# EAGLE design Chroma-Color (EAGLE 6.5.0)
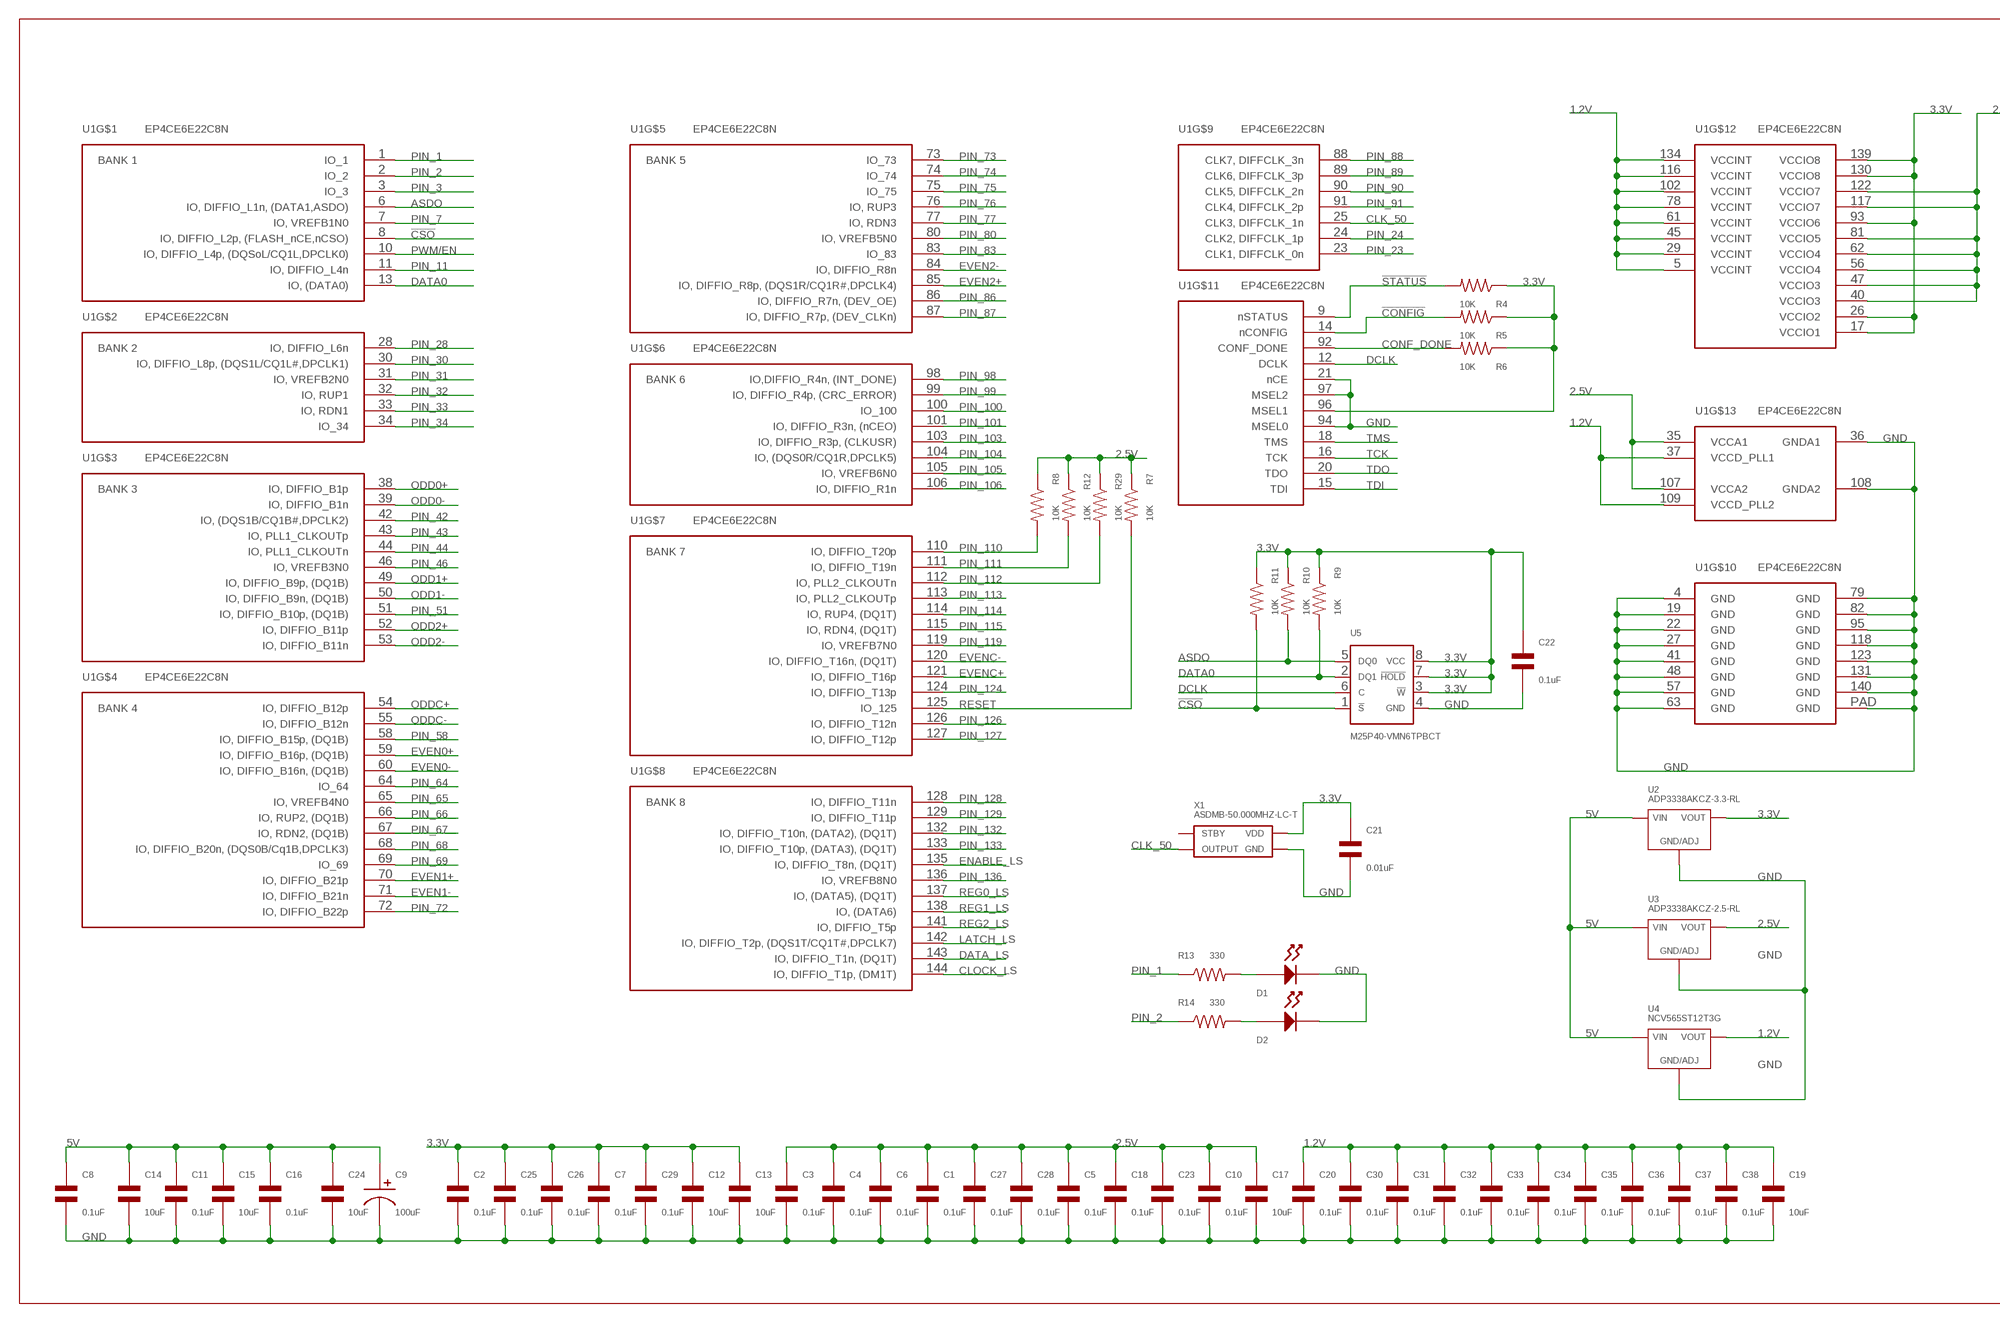
[diagram p0: schematic, sheet 1, part 1 of 2]
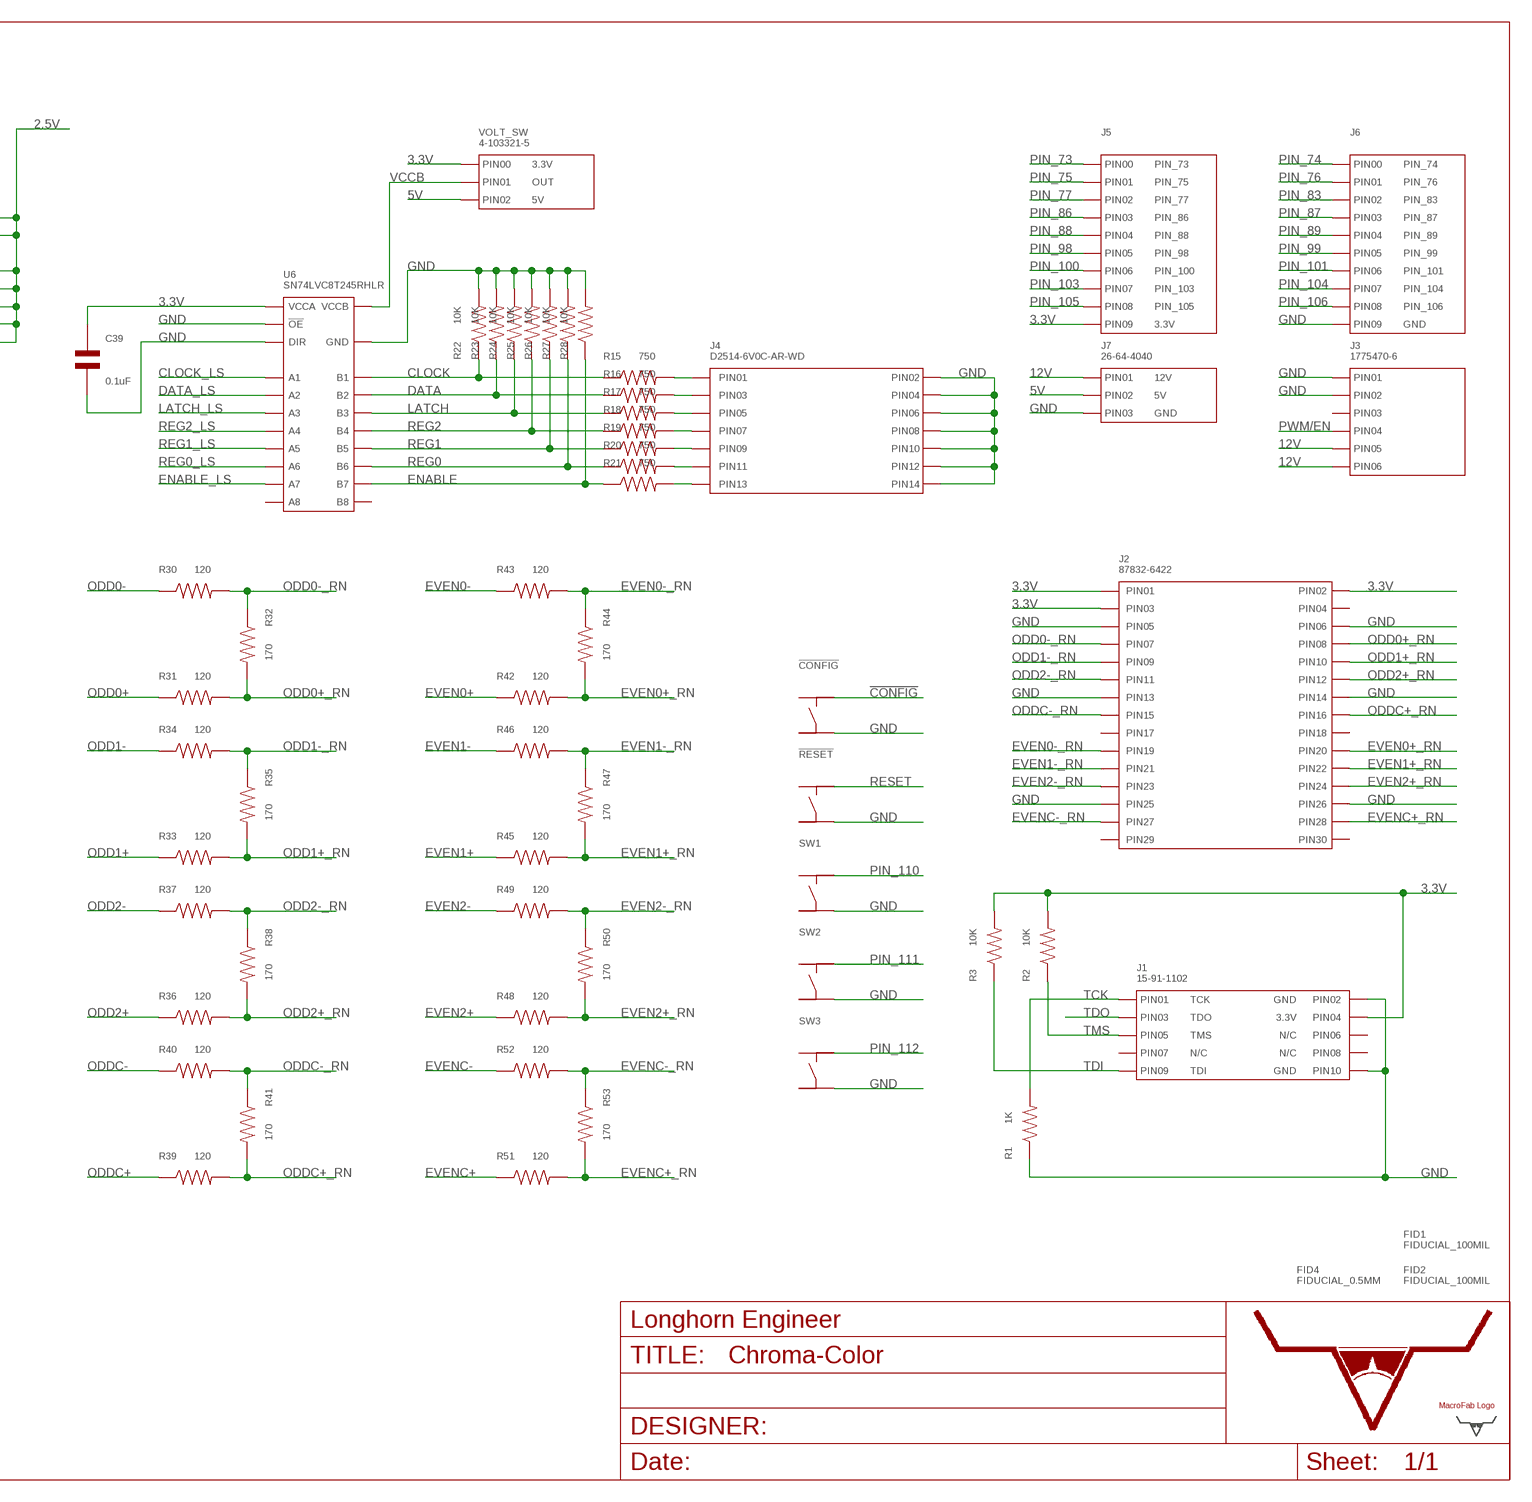
[diagram p1: schematic, sheet 1, part 2 of 2]

## Parts
!CONFIG  TACT_4.2MM  [TACT4.2MM]
!RESET  TACT_4.2MM  [TACT4.2MM]
C1  0.1uF  CAPACITOR_NP_0603  [C0603]
C2  0.1uF  CAPACITOR_NP_0603  [C0603]
C3  0.1uF  CAPACITOR_NP_0603  [C0603]
C4  0.1uF  CAPACITOR_NP_0603  [C0603]
C5  0.1uF  CAPACITOR_NP_0603  [C0603]
C6  0.1uF  CAPACITOR_NP_0603  [C0603]
C7  0.1uF  CAPACITOR_NP_0603  [C0603]
C8  0.1uF  CAPACITOR_NP_0603  [C0603]
C9  100uF  CAPACITOR_P_6.3MM  [CP6.3MM]
C10  0.1uF  CAPACITOR_NP_0603  [C0603]
C11  0.1uF  CAPACITOR_NP_0603  [C0603]
C12  10uF  CAPACITOR_NP_0603  [C0603]
C13  10uF  CAPACITOR_NP_0603  [C0603]
C14  10uF  CAPACITOR_NP_0603  [C0603]
C15  10uF  CAPACITOR_NP_0603  [C0603]
C16  0.1uF  CAPACITOR_NP_0603  [C0603]
C17  10uF  CAPACITOR_NP_0603  [C0603]
C18  0.1uF  CAPACITOR_NP_0603  [C0603]
C19  10uF  CAPACITOR_NP_0603  [C0603]
C20  0.1uF  CAPACITOR_NP_0603  [C0603]
C21  0.01uF  CAPACITOR_NP_0603  [C0603]
C22  0.1uF  CAPACITOR_NP_0603  [C0603]
C23  0.1uF  CAPACITOR_NP_0603  [C0603]
C24  10uF  CAPACITOR_NP_0603  [C0603]
C25  0.1uF  CAPACITOR_NP_0603  [C0603]
C26  0.1uF  CAPACITOR_NP_0603  [C0603]
C27  0.1uF  CAPACITOR_NP_0603  [C0603]
C28  0.1uF  CAPACITOR_NP_0603  [C0603]
C29  0.1uF  CAPACITOR_NP_0603  [C0603]
C30  0.1uF  CAPACITOR_NP_0603  [C0603]
C31  0.1uF  CAPACITOR_NP_0603  [C0603]
C32  0.1uF  CAPACITOR_NP_0603  [C0603]
C33  0.1uF  CAPACITOR_NP_0603  [C0603]
C34  0.1uF  CAPACITOR_NP_0603  [C0603]
C35  0.1uF  CAPACITOR_NP_0603  [C0603]
C36  0.1uF  CAPACITOR_NP_0603  [C0603]
C37  0.1uF  CAPACITOR_NP_0603  [C0603]
C38  0.1uF  CAPACITOR_NP_0603  [C0603]
C39  0.1uF  CAPACITOR_NP_0603  [C0603]
D1  LED_SINGLE_0805  [LED0805]
D2  LED_SINGLE_0805  [LED0805]
FID1  FIDUCIAL_100MIL  [FIDUCIAL_100MIL]
FID2  FIDUCIAL_100MIL  [FIDUCIAL_100MIL]
FID4  FIDUCIAL_0.5MM  [FIDUCIAL_0.5MM]
J1  15-91-1102  CON_02X05_15-91-1102  [15-91-1102]
J2  87832-6422  CON_02X15_87832-6422  [87832-6422]
J3  1775470-6  CON_01X06_1775470-6  [1775470-6]
J4  D2514-6V0C-AR-WD  CON_02X07_D2514-6V0C-AR-WD  [D2514-6V0C-AR-WD]
J5  HEADER_01X10_PTH_2.54MM  [PTH_2.54MM_01X10]
J6  HEADER_01X10_PTH_2.54MM  [PTH_2.54MM_01X10]
J7  26-64-4040  CON_01X03_26-64-4040_(KEYPIN1)  [26-64-4040(KEYPIN1)]
R1  1K  RESISTOR_0603  [R0603]
R2  10K  RESISTOR_0603  [R0603]
R3  10K  RESISTOR_0603  [R0603]
R4  10K  RESISTOR_0603  [R0603]
R5  10K  RESISTOR_0603  [R0603]
R6  10K  RESISTOR_0603  [R0603]
R7  10K  RESISTOR_0603  [R0603]
R8  10K  RESISTOR_0603  [R0603]
R9  10K  RESISTOR_0603  [R0603]
R10  10K  RESISTOR_0603  [R0603]
R11  10K  RESISTOR_0603  [R0603]
R12  10K  RESISTOR_0603  [R0603]
R13  330  RESISTOR_0603  [R0603]
R14  330  RESISTOR_0603  [R0603]
R15  750  RESISTOR_0603  [R0603]
R16  750  RESISTOR_0603  [R0603]
R17  750  RESISTOR_0603  [R0603]
R18  750  RESISTOR_0603  [R0603]
R19  750  RESISTOR_0603  [R0603]
R20  750  RESISTOR_0603  [R0603]
R21  750  RESISTOR_0603  [R0603]
R22  10K  RESISTOR_0603  [R0603]
R23  10K  RESISTOR_0603  [R0603]
R24  10K  RESISTOR_0603  [R0603]
R25  10K  RESISTOR_0603  [R0603]
R26  10K  RESISTOR_0603  [R0603]
R27  10K  RESISTOR_0603  [R0603]
R28  10K  RESISTOR_0603  [R0603]
R29  10K  RESISTOR_0603  [R0603]
R30  120  RESISTOR_0402  [R0402]
R31  120  RESISTOR_0402  [R0402]
R32  170  RESISTOR_0402  [R0402]
R33  120  RESISTOR_0402  [R0402]
R34  120  RESISTOR_0402  [R0402]
R35  170  RESISTOR_0402  [R0402]
R36  120  RESISTOR_0402  [R0402]
R37  120  RESISTOR_0402  [R0402]
R38  170  RESISTOR_0402  [R0402]
R39  120  RESISTOR_0402  [R0402]
R40  120  RESISTOR_0402  [R0402]
R41  170  RESISTOR_0402  [R0402]
R42  120  RESISTOR_0402  [R0402]
R43  120  RESISTOR_0402  [R0402]
R44  170  RESISTOR_0402  [R0402]
R45  120  RESISTOR_0402  [R0402]
R46  120  RESISTOR_0402  [R0402]
R47  170  RESISTOR_0402  [R0402]
R48  120  RESISTOR_0402  [R0402]
R49  120  RESISTOR_0402  [R0402]
R50  170  RESISTOR_0402  [R0402]
R51  120  RESISTOR_0402  [R0402]
R52  120  RESISTOR_0402  [R0402]
R53  170  RESISTOR_0402  [R0402]
SW1  TACT_4.2MM  [TACT4.2MM]
SW2  TACT_4.2MM  [TACT4.2MM]
SW3  TACT_4.2MM  [TACT4.2MM]
U1  EP4CE6E22C8N  [EQFP-144]
U2  ADP3338AKCZ-3.3-RL  LINEAR_VOTLAGE_REGULATORS_ADP3338  [ADP3338_SOT-223-3]
U3  ADP3338AKCZ-2.5-RL  LINEAR_VOTLAGE_REGULATORS_ADP3338  [ADP3338_SOT-223-3]
U4  NCV565ST12T3G  LINEAR_VOTLAGE_REGULATORS_NCV565ST12T3G  [NCV565_SOT-223-3]
U5  M25P40-VMN6TPBCT  [M25P40_SOIC-8]
U6  SN74LVC8T245RHLR  SN74LVC8T245_RHL  [SN74LVC8T245_VQFN-24]
U$1  LHE_FRAME  [LHE_FRAME]
U$2  MF_LOGOLOGO_MEDIUM  [MF_LOGO_MEDIUM]
U$3  LHE_LOGOLHE_LOGO  [LHE_LOGO]
VOLT_SW  4-103321-5  HEADER_01X03_PTH_2.54MM  [PTH_2.54MM_01X03]
X1  ASDMB-50.000MHZ-LC-T  ASDMB  [ASDMB]

## Nets
1.2V: C19.P$1 C20.P$1 C30.P$1 C31.P$1 C32.P$1 C33.P$1 C34.P$1 C35.P$1 C36.P$1 C37.P$1 C38.P$1 U1.5 U1.29 U1.37 U1.45 U1.61 U1.78 U1.102 U1.109 U1.116 U1.134 U4.2(OUT) U4.PAD(OUT)
2.5V: C1.P$1 C3.P$1 C4.P$1 C5.P$1 C6.P$1 C10.P$1 C17.P$1 C18.P$1 C23.P$1 C27.P$1 C28.P$1 R7.P$1 R8.P$1 R12.P$1 R29.P$1 U1.35 U1.40 U1.47 U1.56 U1.62 U1.81 U1.107 U1.117 U1.122 U3.2(OUT) U3.PAD(OUT)
3.3V: C2.P$1 C7.P$1 C12.P$1 C13.P$1 C21.P$1 C22.P$1 C25.P$1 C26.P$1 C29.P$1 C39.P$1 J1.4(PIN4) J2.P$1(PIN0) J2.P$2(PIN1) J2.P$3(PIN2) J5.P$10(PIN9) R2.P$2 R3.P$2 R4.P$1 R5.P$1 R6.P$1 R9.P$1 R10.P$1 R11.P$1 U1.17 U1.26 U1.93 U1.96 U1.130 U1.139 U2.2(OUT) U2.PAD(OUT) U5.3(!W) U5.7(!HOLD) U5.8(VCC) U6.1(VCCA) VOLT_SW.P$1(PIN0) X1.P$4(VDD)
5V: C8.P$1 C9.P$1 C11.P$1 C14.P$1 C15.P$1 C16.P$1 C24.P$1 J7.3(PIN2) U2.3(IN) U3.3(IN) U4.3(IN) VOLT_SW.P$3(PIN2)
12V: J3.P$5 J3.P$6 J7.2(PIN1)
!CONFIG: !CONFIG.P$2 R5.P$2 U1.14
!CSO: R11.P$2 U1.8 U5.1(!S)
!STATUS: R4.P$2 U1.9
ASDO: R10.P$2 U1.6 U5.5(DQ0)
CLK_50: U1.25 X1.P$3(OUTPUT)
CLOCK: R15.P$1 R22.P$1 U6.21(B1)
CLOCK_LS: U1.144 U6.3(A1)
CONF_DONE: R6.P$2 U1.92
DATA: R16.P$1 R23.P$1 U6.20(B2)
DATA0: R9.P$2 U1.13 U5.2(DQ1)
DATA_LS: U1.143 U6.4(A2)
DCLK: U1.12 U5.6(C)
ENABLE: R21.P$1 R28.P$1 U6.15(B7)
ENABLE_LS: U1.135 U6.9(A7)
EVEN0+: R42.P$1 U1.59
EVEN0+_RN: J2.P$20(PIN19) R42.P$2 R44.P$2
EVEN0-: R43.P$1 U1.60
EVEN0-_RN: J2.P$19(PIN18) R43.P$2 R44.P$1
EVEN1+: R45.P$1 U1.70
EVEN1+_RN: J2.P$22(PIN21) R45.P$2 R47.P$2
EVEN1-: R46.P$1 U1.71
EVEN1-_RN: J2.P$21(PIN20) R46.P$2 R47.P$1
EVEN2+: R48.P$1 U1.85
EVEN2+_RN: J2.P$24(PIN23) R48.P$2 R50.P$2
EVEN2-: R49.P$1 U1.84
EVEN2-_RN: J2.P$23(PIN22) R49.P$2 R50.P$1
EVENC+: R51.P$1 U1.121
EVENC+_RN: J2.P$28(PIN27) R51.P$2 R53.P$2
EVENC-: R52.P$1 U1.120
EVENC-_RN: J2.P$27(PIN26) R52.P$2 R53.P$1
GND: !CONFIG.P$4 !RESET.P$4 C1.P$2 C2.P$2 C3.P$2 C4.P$2 C5.P$2 C6.P$2 C7.P$2 C8.P$2 C9.P$2 C10.P$2 C11.P$2 C12.P$2 C13.P$2 C14.P$2 C15.P$2 C16.P$2 C17.P$2 C18.P$2 C19.P$2 C20.P$2 C21.P$2 C22.P$2 C23.P$2 C24.P$2 C25.P$2 C26.P$2 C27.P$2 C28.P$2 C29.P$2 C30.P$2 C31.P$2 C32.P$2 C33.P$2 C34.P$2 C35.P$2 C36.P$2 C37.P$2 C38.P$2 C39.P$2 D1.CATHODE D2.CATHODE J1.2(PIN2) J1.10(PIN10) J2.P$5(PIN4) J2.P$6(PIN5) J2.P$13(PIN12) J2.P$14(PIN13) J2.P$25(PIN24) J2.P$26(PIN25) J3.P$1 J3.P$2 J4.2(PIN2) J4.4(PIN4) J4.6(PIN6) J4.8(PIN8) J4.10(PIN10) J4.12(PIN12) J4.14(PIN14) J6.P$10(PIN9) J7.4(PIN3) R1.P$1 R22.P$2 R23.P$2 R24.P$2 R25.P$2 R26.P$2 R27.P$2 R28.P$2 SW1.P$4 SW2.P$4 SW3.P$4 U1.4 U1.19 U1.21 U1.22 U1.27 U1.36 U1.41 U1.48 U1.57 U1.63 U1.79 U1.82 U1.94 U1.95 U1.97 U1.108 U1.118 U1.123 U1.131 U1.140 U1.PAD U2.1(GND) U3.1(GND) U4.1(GND) U5.4(GND) U6.2(DIR) U6.11(GND) U6.12(GND) U6.13(GND) U6.22(!OE) X1.P$2(GND)
LATCH: R17.P$1 R24.P$1 U6.19(B3)
LATCH_LS: U1.142 U6.5(A3)
N$1: D1.ANODE R13.P$2
N$2: D2.ANODE R14.P$2
N$3: J4.1(PIN1) R15.P$2
N$4: J4.3(PIN3) R16.P$2
N$5: J4.5(PIN5) R17.P$2
N$6: J4.7(PIN7) R18.P$2
N$7: J4.9(PIN9) R19.P$2
N$8: J4.11(PIN11) R20.P$2
N$9: J4.13(PIN13) R21.P$2
ODD0+: R31.P$1 U1.38
ODD0+_RN: J2.P$8(PIN7) R31.P$2 R32.P$2
ODD0-: R30.P$1 U1.39
ODD0-_RN: J2.P$7(PIN6) R30.P$2 R32.P$1
ODD1+: R33.P$1 U1.49
ODD1+_RN: J2.P$10(PIN9) R33.P$2 R35.P$2
ODD1-: R34.P$1 U1.50
ODD1-_RN: J2.P$9(PIN8) R34.P$2 R35.P$1
ODD2+: R36.P$1 U1.52
ODD2+_RN: J2.P$12(PIN11) R36.P$2 R38.P$2
ODD2-: R37.P$1 U1.53
ODD2-_RN: J2.P$11(PIN10) R37.P$2 R38.P$1
ODDC+: R39.P$1 U1.54
ODDC+_RN: J2.P$16(PIN15) R39.P$2 R41.P$2
ODDC-: R40.P$1 U1.55
ODDC-_RN: J2.P$15(PIN14) R40.P$2 R41.P$1
PIN_1: R13.P$1 U1.1
PIN_2: R14.P$1 U1.2
PIN_3: U1.3
PIN_7: U1.7
PIN_11: U1.11
PIN_23: U1.23
PIN_24: U1.24
PIN_28: U1.28
PIN_30: U1.30
PIN_31: U1.31
PIN_32: U1.32
PIN_33: U1.33
PIN_34: U1.34
PIN_42: U1.42
PIN_43: U1.43
PIN_44: U1.44
PIN_46: U1.46
PIN_51: U1.51
PIN_58: U1.58
PIN_64: U1.64
PIN_65: U1.65
PIN_66: U1.66
PIN_67: U1.67
PIN_68: U1.68
PIN_69: U1.69
PIN_72: U1.72
PIN_73: J5.P$1(PIN0) U1.73
PIN_74: J6.P$1(PIN0) U1.74
PIN_75: J5.P$2(PIN1) U1.75
PIN_76: J6.P$2(PIN1) U1.76
PIN_77: J5.P$3(PIN2) U1.77
PIN_80: U1.80
PIN_83: J6.P$3(PIN2) U1.83
PIN_86: J5.P$4(PIN3) U1.86
PIN_87: J6.P$4(PIN3) U1.87
PIN_88: J5.P$5(PIN4) U1.88
PIN_89: J6.P$5(PIN4) U1.89
PIN_90: U1.90
PIN_91: U1.91
PIN_98: J5.P$6(PIN5) U1.98
PIN_99: J6.P$6(PIN5) U1.99
PIN_100: J5.P$7(PIN6) U1.100
PIN_101: J6.P$7(PIN6) U1.101
PIN_103: J5.P$8(PIN7) U1.103
PIN_104: J6.P$8(PIN7) U1.104
PIN_105: J5.P$9(PIN8) U1.105
PIN_106: J6.P$9(PIN8) U1.106
PIN_110: R8.P$2 SW1.P$2 U1.110
PIN_111: R12.P$2 SW2.P$2 U1.111
PIN_112: R29.P$2 SW3.P$2 U1.112
PIN_113: U1.113
PIN_114: U1.114
PIN_115: U1.115
PIN_119: U1.119
PIN_124: U1.124
PIN_126: U1.126
PIN_127: U1.127
PIN_128: U1.128
PIN_129: U1.129
PIN_132: U1.132
PIN_133: U1.133
PIN_136: U1.136
PWM/EN: J3.P$4 U1.10
REG0: R20.P$1 R27.P$1 U6.16(B6)
REG0_LS: U1.137 U6.8(A6)
REG1: R19.P$1 R26.P$1 U6.17(B5)
REG1_LS: U1.138 U6.7(A5)
REG2: R18.P$1 R25.P$1 U6.18(B4)
REG2_LS: U1.141 U6.6(A4)
RESET: !RESET.P$2 R7.P$2 U1.125
TCK: J1.1(PIN1) R1.P$2 U1.16
TDI: J1.9(PIN9) R3.P$1 U1.15
TDO: J1.3(PIN3) U1.20
TMS: J1.5(PIN5) R2.P$1 U1.18
VCCB: U6.23(VCCB) U6.24(VCCB) VOLT_SW.P$2(PIN1)
Unconnected: !CONFIG.P$1 !CONFIG.P$3 !RESET.P$1 !RESET.P$3 J1.6(PIN6) J1.7(PIN7) J1.8(PIN8) J2.P$4(PIN3) J2.P$17(PIN16) J2.P$18(PIN17) J2.P$29(PIN28) J2.P$30(PIN29) J3.P$3 SW1.P$1 SW1.P$3 SW2.P$1 SW2.P$3 SW3.P$1 SW3.P$3 U6.10(A8) U6.14(B8) X1.P$1(STBY)

## Library data of the parts
!CONFIG !RESET SW1-SW3 = MF_Switches:TACT: Library: MF_Switches Description: Device for Tact Switches. Manufacture part number (MFG#) can be added via Attributes.
C1-C8 C10-C39 = MF_Passives:CAPACITOR_NP: Library: MF_Passives Description: Device for Non-Polarized Capacitors. Manufacture part number (MFG#), Voltage, Temperature Coefficient, and Tolerance can be added via Attributes.; MFG#: N/A; TEMP_COF: N/A; TOLERANCE: N/A; VOLTAGE: N/A
C9 = MF_Passives:CAPACITOR_P: Library: MF_Passives Description: Device for Polarized Capacitors. Manufacture part number (MFG#), Voltage Rating, and Tolerance can be added via Attributes.; MFG#: N/A; TOLERANCE: N/A; VOTLAGE: N/A
D1 D2 = MF_LEDs:LED_SINGLE: Library: MF_LEDs Description: Device for Single LED Packages. Manufacture part number (MFG#) can be added via Attributes.
FID1 FID2 FID4 = MF_Aesthetics:FIDUCIAL: Library: MF_Aesthetics Description: Fiducial marking for PCB alignment inside PNP and other machines.
J1 = PP_Connectors:CON_02X05; LABEL01: TCK; LABEL02: GND; LABEL03: TDO; LABEL04: 3.3V; LABEL05: TMS; LABEL06: N/C; LABEL07: N/C; LABEL08: N/C; LABEL09: TDI; LABEL10: GND
J2 = PP_Connectors:CON_02X15
J3 = PP_Connectors:CON_01X06: 6 pin connectors
J4 = PP_Connectors:CON_02X07
J5 = MF_Connectors:HEADER_01X10: Library: MF_Connectors Description: Header Connector with 10 Positions and 01 Rows. Use the LABEL Attribute to label the pin on the schematic and PCB. You can remove the attributes on the PCB by using the SMASH function on the part and then deleting the text.; LABEL00: PIN_73; LABEL01: PIN_75; LABEL02: PIN_77; LABEL03: PIN_86; LABEL04: PIN_88; LABEL05: PIN_98; LABEL06: PIN_100; LABEL07: PIN_103; LABEL08: PIN_105; LABEL09: 3.3V
J6 = MF_Connectors:HEADER_01X10: Library: MF_Connectors Description: Header Connector with 10 Positions and 01 Rows. Use the LABEL Attribute to label the pin on the schematic and PCB. You can remove the attributes on the PCB by using the SMASH function on the part and then deleting the text.; LABEL00: PIN_74; LABEL01: PIN_76; LABEL02: PIN_83; LABEL03: PIN_87; LABEL04: PIN_89; LABEL05: PIN_99; LABEL06: PIN_101; LABEL07: PIN_104; LABEL08: PIN_106; LABEL09: GND
J7 = PP_Connectors:CON_01X03: 3 pin connectors; LABEL01: 12V; LABEL02: 5V; LABEL03: GND
R1-R53 = MF_Passives:RESISTOR: Library: MF_Passives Description: Device for Resistors. Manufacture part number (MFG#), Voltage, Tolerance, and Wattage Rating can be added via Attributes.; MFG#: N/A; TOLERANCE: N/A; VOLTAGE: N/A; WATTAGE: N/A
U1 = PP_DigitalIC:EP4CE6E22C8N: Manufacturer Part #: EP4CE6E22C8N Manufacturer: Altera Description: FPGA - Field Programmable Gate Array FPGA - Cyclone IV E 392 LABs 91 IOs URL: http://www.mouser.com/ds/2/591/cyiv-51001-472857.pdf
U2-U4 = PP_PowerIC:LINEAR_VOTLAGE_REGULATORS
U5 = PP_DigitalIC:M25P40: Manufacturer Part #: M25P40 Manufacturer: Micron Technology Inc. Description: IC FLASH 4MBIT 75MHZ
U6 = PP_DigitalIC:SN74LVC8T245: Manufacturer Part #: SN74LVC8T245 Manufacturer: Texas Instruments Description: Translation - Voltage Levels 8-Bit Dual-Supply Bus Xcvr
U$1 = PP_Aesthetics:LHE_FRAME; DNAME: Parker Dillmann; REVNUM: REV: 2
U$2 = PP_Aesthetics:MF_LOGO
U$3 = PP_Aesthetics:LHE_LOGO
VOLT_SW = MF_Connectors:HEADER_01X03: Library: MF_Connectors Description: Header Connector with 03 Positions and 01 Rows. Use the LABEL Attribute to label the pin on the schematic and PCB. You can remove the attributes on the PCB by using the SMASH function on the part and then deleting the text.; LABEL00: 3.3V; LABEL01: OUT; LABEL02: 5V
X1 = PP_FreqCtrl:ASDMB: Manufacturer Part #: ASDMB series clock oscillator Manufacturer: ABRACON Description: Standard Clock Oscillators

## Board
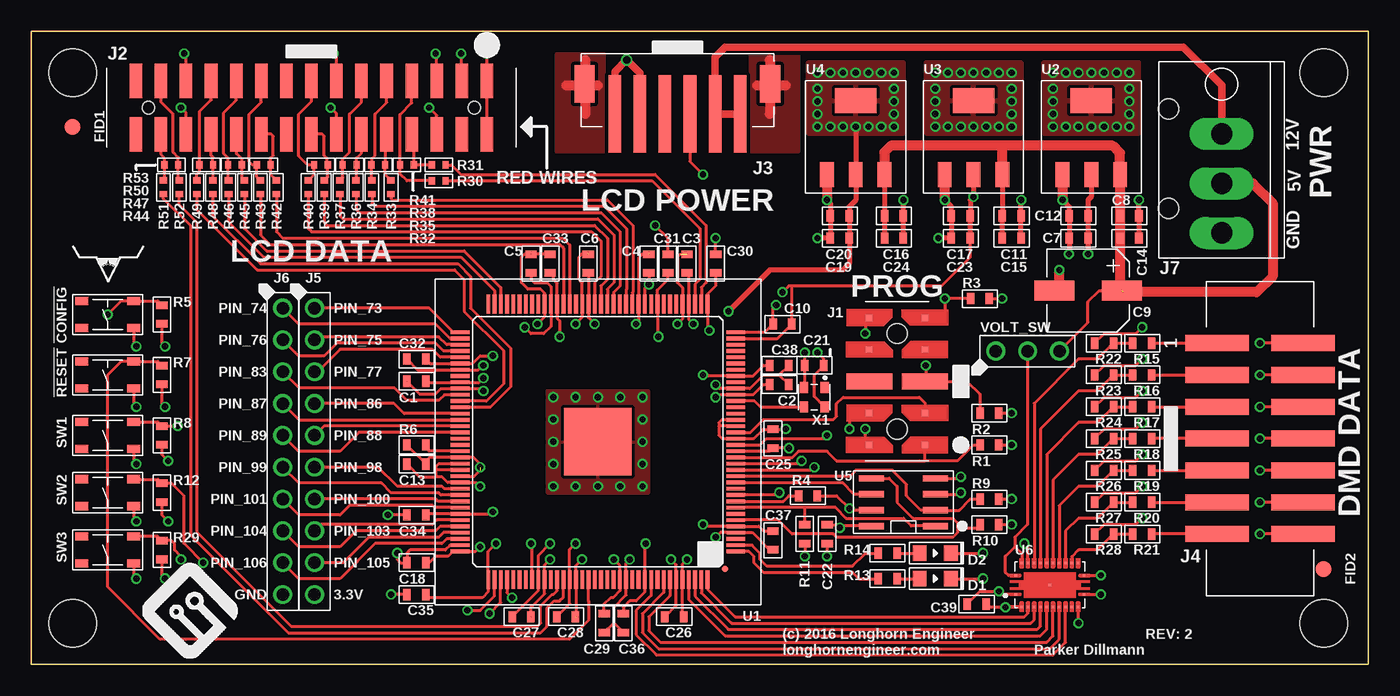
[diagram p2: board, top side]
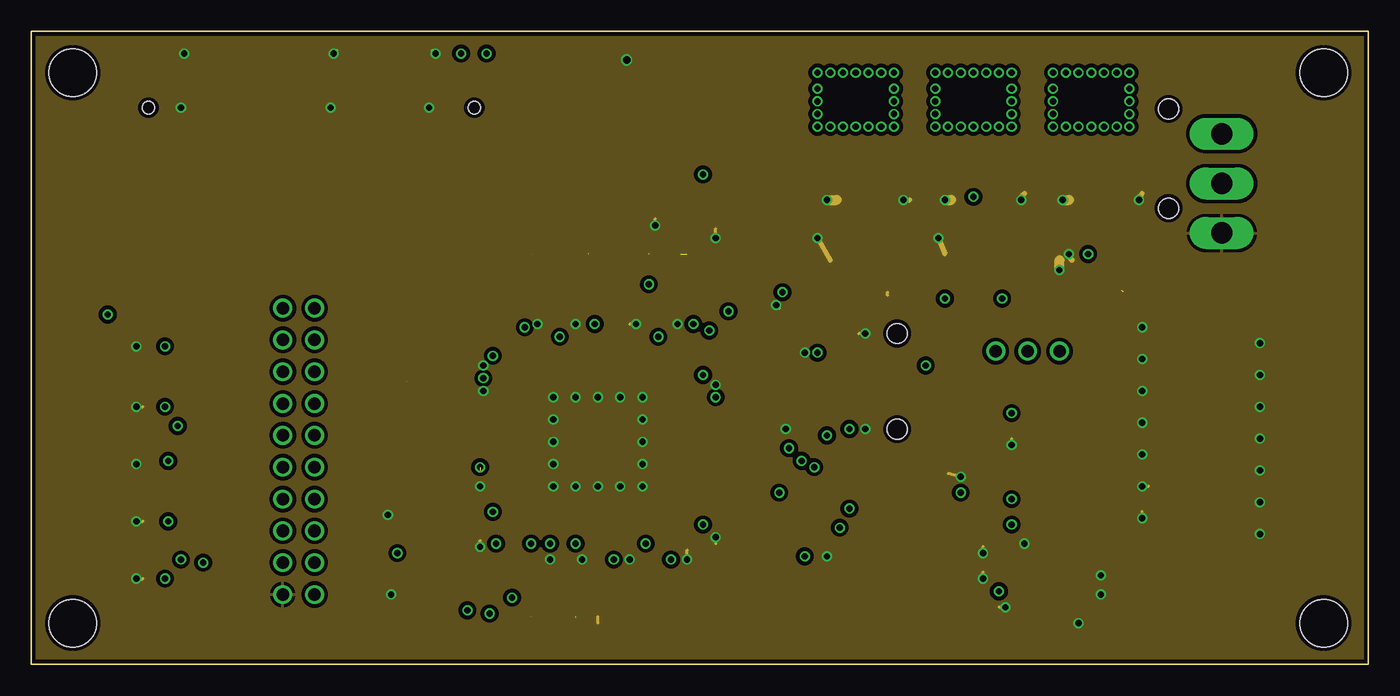
[diagram p3: board, inner layer Route2]
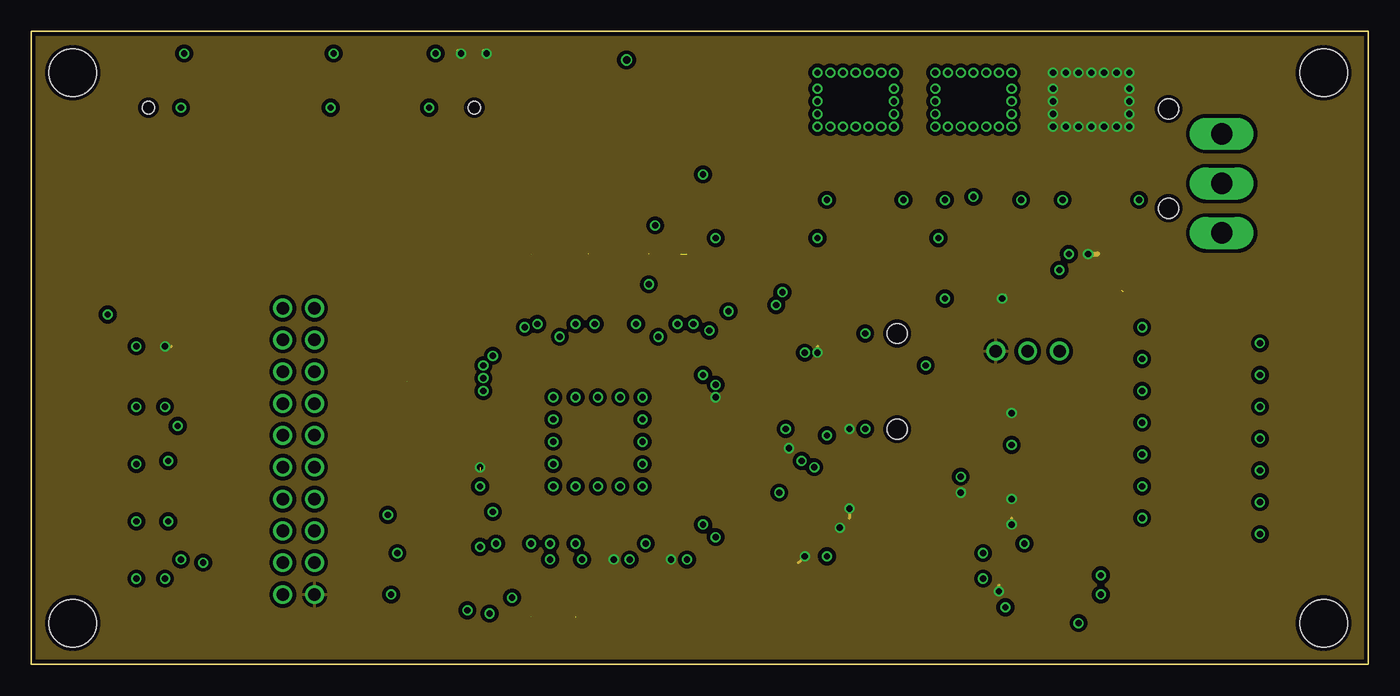
[diagram p4: board, inner layer Route15]
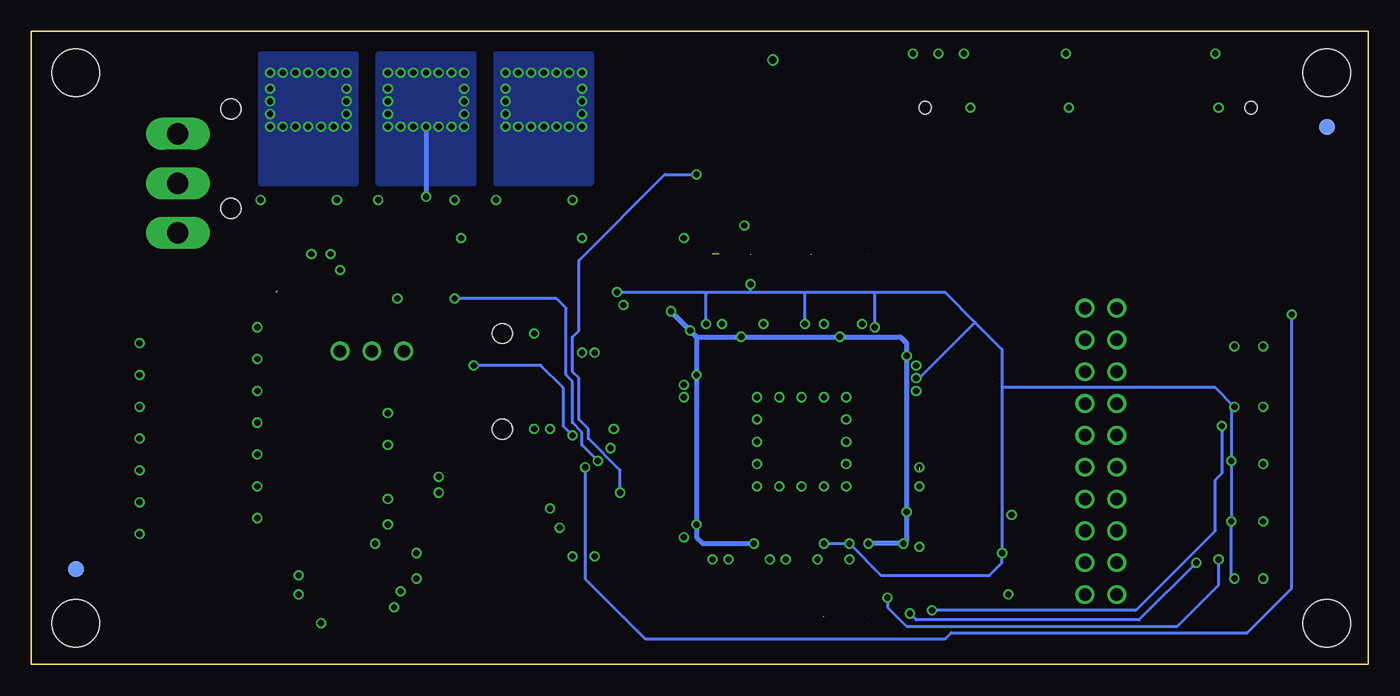
[diagram p5: board, bottom side, seen from below]

Size 106.68 x 50.55 mm. Coordinates in mm from the lower left corner, seen from the top.
Outline: 0,0 0,50.55 106.68,50.55 106.68,0 0,0
Copper layers (1*2*15*16): Top 0.035mm / dielectric 0.23mm / Route2 0.035mm / dielectric 0.93mm / Route15 0.035mm / dielectric 0.23mm / Bottom 0.035mm
Design rules "MF_Standard_4_Layer": minimum track width 6mil, minimum drill 12mil, track to track 6mil, track to pad 6mil, pad to pad 6mil, via to via 6mil, smd to smd 0mil, copper to edge 10mil, drill to drill 10mil, minimum pad ring 6mil, minimum via ring 6mil, stop-mask expansion 2mil, vias tented up to drill 25mil, thermal gap 10mil
Holes 3.8 mm at 3.3,3.3 103.12,3.3 103.12,47.24 3.3,47.24

### Footprints (pad centres in the part's own frame; a part is rotated, then mirrored left to right if it is on the bottom)
TACT4.2MM = smd 1.05 x 0.65: P$1 -2.075,1.075; P$2 2.075,1.075; P$3 -2.075,-1.075; P$4 2.075,-1.075
C0603 = smd 0.6 x 0.9: P$1 -0.75,0; P$2 0.75,0
CP6.3MM = smd 1.6 x 3.2: P$1 0,-2.7; P$2 0,2.7
LED0805 = smd 1.1 x 1.25: ANODE 1.25,0; CATHODE -1.25,0
FIDUCIAL_100MIL = smd 1.27 x 1.27: P$1 0,0 | smd 1.27 x 1.27 bottom: P$2 0,0
FIDUCIAL_0.5MM = smd 0.5 x 0.5: FID 0,0
15-91-1102 = smd 0.5 x 0.5: 1 -5.08,-2.22; 2 -5.08,2.22; 3 -2.54,-2.22; 4 -2.54,2.22; 7 2.54,-2.22; 8 2.54,2.22; 9 5.08,-2.22; 10 5.08,2.22 | smd 1.27 x 3.68: 5 0,-2.22; 6 0,2.22 | hole 1.6: -3.81,0; 3.81,0
87832-6422 = smd 1 x 2.75: P$1 -14,-2.125; P$2 -14,2.125; P$3 -12,-2.125; P$4 -12,2.125; P$5 -10,-2.125; P$6 -10,2.125; P$7 -8,-2.125; P$8 -8,2.125; P$9 -6,-2.125; P$10 -6,2.125; P$11 -4,-2.125; P$12 -4,2.125; P$13 -2,-2.125; P$14 -2,2.125; P$15 0,-2.125; P$16 0,2.125; P$17 2,-2.125; P$18 2,2.125; P$19 4,-2.125; P$20 4,2.125; P$21 6,-2.125; P$22 6,2.125; P$23 8,-2.125; P$24 8,2.125; P$25 10,-2.125; P$26 10,2.125; P$27 12,-2.125; P$28 12,2.125; P$29 14,-2.125; P$30 14,2.125 | hole 1: -13,0; 13,0
1775470-6 = smd 1 x 6.2: P$1 5,0; P$2 3,0; P$3 1,0; P$4 -1,0; P$5 -3,0; P$6 -5,0 | smd 1.6 x 3: S0 -7.4,-2.4; S1 7.4,-2.4
D2514-6V0C-AR-WD = smd 1.27 x 5.08: 1 -7.62,-3.429; 2 -7.62,3.429; 3 -5.08,-3.429; 4 -5.08,3.429; 5 -2.54,-3.429; 6 -2.54,3.429; 7 0,-3.429; 8 0,3.429; 9 2.54,-3.429; 10 2.54,3.429; 11 5.08,-3.429; 12 5.08,3.429; 13 7.62,-3.429; 14 7.62,3.429
PTH_2.54MM_01X10 = drill 1: P$1 -11.43,0; P$2 -8.89,0; P$3 -6.35,0; P$4 -3.81,0; P$5 -1.27,0; P$6 1.27,0; P$7 3.81,0; P$8 6.35,0; P$9 8.89,0; P$10 11.43,0
26-64-4040(KEYPIN1) = drill 1.702 long: 2 -1.98,0; 3 1.98,0; 4 5.94,0 | hole 1.6: 3.96,-4.24; -3.96,-4.24
R0603 = smd 0.6 x 0.9: P$1 -0.75,0; P$2 0.75,0
R0402 = smd 0.5 x 0.6: P$1 -0.55,0; P$2 0.55,0
EQFP-144 = smd 1.5 x 0.3: 1 -11,8.75; 2 -11,8.25; 3 -11,7.75; 4 -11,7.25; 5 -11,6.75; 6 -11,6.25; 7 -11,5.75; 8 -11,5.25; 9 -11,4.75; 10 -11,4.25; 11 -11,3.75; 12 -11,3.25; 13 -11,2.75; 14 -11,2.25; 15 -11,1.75; 16 -11,1.25; 17 -11,0.75; 18 -11,0.25; 19 -11,-0.25; 20 -11,-0.75; 21 -11,-1.25; 22 -11,-1.75; 23 -11,-2.25; 24 -11,-2.75; 25 -11,-3.25; 26 -11,-3.75; 27 -11,-4.25; 28 -11,-4.75; 29 -11,-5.25; 30 -11,-5.75; 31 -11,-6.25; 32 -11,-6.75; 33 -11,-7.25; 34 -11,-7.75; 35 -11,-8.25; 36 -11,-8.75; 73 11,-8.75; 74 11,-8.25; 75 11,-7.75; 76 11,-7.25; 77 11,-6.75; 78 11,-6.25; 79 11,-5.75; 80 11,-5.25; 81 11,-4.75; 82 11,-4.25; 83 11,-3.75; 84 11,-3.25; 85 11,-2.75; 86 11,-2.25; 87 11,-1.75; 88 11,-1.25; 89 11,-0.75; 90 11,-0.25; 91 11,0.25; 92 11,0.75; 93 11,1.25; 94 11,1.75; 95 11,2.25; 96 11,2.75; 97 11,3.25; 98 11,3.75; 99 11,4.25; 100 11,4.75; 101 11,5.25; 102 11,5.75; 103 11,6.25; 104 11,6.75; 105 11,7.25; 106 11,7.75; 107 11,8.25; 108 11,8.75 | smd 0.3 x 1.5: 37 -8.75,-11; 38 -8.25,-11; 39 -7.75,-11; 40 -7.25,-11; 41 -6.75,-11; 42 -6.25,-11; 43 -5.75,-11; 44 -5.25,-11; 45 -4.75,-11; 46 -4.25,-11; 47 -3.75,-11; 48 -3.25,-11; 49 -2.75,-11; 50 -2.25,-11; 51 -1.75,-11; 52 -1.25,-11; 53 -0.75,-11; 54 -0.25,-11; 55 0.25,-11; 56 0.75,-11; 57 1.25,-11; 58 1.75,-11; 59 2.25,-11; 60 2.75,-11; 61 3.25,-11; 62 3.75,-11; 63 4.25,-11; 64 4.75,-11; 65 5.25,-11; 66 5.75,-11; 67 6.25,-11; 68 6.75,-11; 69 7.25,-11; 70 7.75,-11; 71 8.25,-11; 72 8.75,-11; 109 8.75,11; 110 8.25,11; 111 7.75,11; 112 7.25,11; 113 6.75,11; 114 6.25,11; 115 5.75,11; 116 5.25,11; 117 4.75,11; 118 4.25,11; 119 3.75,11; 120 3.25,11; 121 2.75,11; 122 2.25,11; 123 1.75,11; 124 1.25,11; 125 0.75,11; 126 0.25,11; 127 -0.25,11; 128 -0.75,11; 129 -1.25,11; 130 -1.75,11; 131 -2.25,11; 132 -2.75,11; 133 -3.25,11; 134 -3.75,11; 135 -4.25,11; 136 -4.75,11; 137 -5.25,11; 138 -5.75,11; 139 -6.25,11; 140 -6.75,11; 141 -7.25,11; 142 -7.75,11; 143 -8.25,11; 144 -8.75,11 | smd 5.4 x 5.4: PAD 0,0
ADP3338_SOT-223-3 = smd 1.1 x 2: 1 -2.3,-2.54; 2 0,-2.54; 3 2.3,-2.54 | smd 3.3 x 2: PAD 0,3.36
NCV565_SOT-223-3 = smd 1.1 x 2: 1 -2.3,-2.54; 2 0,-2.54; 3 2.3,-2.54 | smd 3.3 x 2: PAD 0,3.36
M25P40_SOIC-8 = smd 2 x 0.5: 1 -2.55,1.905; 2 -2.55,0.635; 3 -2.55,-0.635; 4 -2.55,-1.905; 5 2.55,-1.905; 6 2.55,-0.635; 7 2.55,0.635; 8 2.55,1.905
SN74LVC8T245_VQFN-24 = smd 0.2 x 0.2: 1 -2.75,-0.75; 2 -2.25,-1.75; 3 -1.75,-1.75; 4 -1.25,-1.75; 5 -0.75,-1.75; 6 -0.25,-1.75; 7 0.25,-1.75; 8 0.75,-1.75; 9 1.25,-1.75; 10 1.75,-1.75; 11 2.25,-1.75; 12 2.75,-0.75; 13 2.75,0.75; 14 2.25,1.75; 15 1.75,1.75; 16 1.25,1.75; 17 0.75,1.75; 18 0.25,1.75; 19 -0.25,1.75; 20 -0.75,1.75; 21 -1.25,1.75; 22 -1.75,1.75; 23 -2.25,1.75; 24 -2.75,0.75; TP 0,0
PTH_2.54MM_01X03 = drill 1: P$1 -2.54,0; P$2 0,0; P$3 2.54,0
ASDMB = smd 0.65 x 0.85: P$1 -0.825,-0.775; P$2 0.825,-0.775; P$3 0.825,0.775; P$4 -0.825,0.775

### Placement (x,y rotation side)
!CONFIG  6.1,27.94 0 top
!RESET  6.1,23.11 0 top
C1  30.73,22.61 180 top
C2  59.69,22.35 0 top
C3  52.32,32 90 top
C4  49.28,32 90 top
C5  39.88,32 90 top
C6  44.45,32 90 top
C7  83.57,34.04 180 top
C8  87.63,35.81 0 top
C9  84.33,29.84 90 top
C10  59.94,27.18 180 top
C11  78.23,35.81 0 top
C12  83.57,35.81 180 top
C13  30.73,16 180 top
C14  87.63,34.04 0 top
C15  78.23,34.04 0 top
C16  68.83,35.81 0 top
C17  74.17,35.81 180 top
C18  30.73,8.13 0 top
C19  64.52,34.04 180 top
C20  64.52,35.81 180 top
C21  62.48,23.88 180 top
C22  63.5,10.41 270 top
C23  74.17,34.04 180 top
C24  68.83,34.04 0 top
C25  59.18,18.03 90 top
C26  51.31,3.81 0 top
C27  39.12,3.81 0 top
C28  42.67,3.81 0 top
C29  45.72,3.3 270 top
C30  54.61,32 90 top
C31  50.8,32 90 top
C32  30.73,24.38 180 top
C33  41.4,32 90 top
C34  30.73,11.94 180 top
C35  30.73,5.59 180 top
C36  47.24,3.3 270 top
C37  59.18,9.91 270 top
C38  59.69,23.88 0 top
C39  75.44,4.83 0 top
D1  72.14,6.86 180 top
D2  72.14,8.89 180 top
FID1  3.3,42.93 270 top
FID2  103.12,7.62 270 top
FID4  55.37,7.62 0 top
J1  69.09,22.61 90 top
J2  22.35,44.45 180 top
J3  51.56,43.94 180 top
J4  98.04,18.03 270 top
J5  22.61,17.02 270 top
J6  20.07,17.02 270 top
J7  95,40.39 270 top
R1  76.45,17.53 180 top
R2  76.45,20.07 0 top
R3  75.69,29.21 0 top
R4  61.98,13.46 180 top
R5  10.41,27.94 90 top
R6  30.73,17.53 0 top
R7  10.41,23.11 90 top
R8  10.41,18.29 90 top
R9  76.45,13.21 180 top
R10  76.45,11.18 180 top
R11  61.72,10.41 90 top
R12  10.41,13.72 90 top
R13  68.33,6.86 0 top
R14  68.33,8.89 0 top
R15  88.65,25.65 0 top
R16  88.65,23.11 0 top
R17  88.65,20.57 0 top
R18  88.65,18.03 0 top
R19  88.65,15.49 0 top
R20  88.65,12.95 0 top
R21  88.65,10.41 0 top
R22  85.6,25.65 180 top
R23  85.6,23.11 180 top
R24  85.6,20.57 180 top
R25  85.6,18.03 180 top
R26  85.6,15.49 180 top
R27  85.6,12.95 180 top
R28  85.6,10.41 180 top
R29  10.41,9.14 90 top
R30  32.51,38.61 180 top
R31  32.51,39.88 180 top
R32  29.97,39.88 0 top
R33  28.7,38.1 90 top
R34  27.18,38.1 90 top
R35  27.69,39.88 0 top
R36  25.91,38.1 90 top
R37  24.64,38.1 90 top
R38  25.4,39.88 0 top
R39  23.37,38.1 90 top
R40  22.1,38.1 90 top
R41  23.11,39.88 0 top
R42  19.56,38.1 90 top
R43  18.29,38.1 90 top
R44  18.54,39.88 0 top
R45  17.02,38.1 90 top
R46  15.75,38.1 90 top
R47  16.26,39.88 0 top
R48  14.48,38.1 90 top
R49  13.21,38.1 90 top
R50  13.97,39.88 0 top
R51  10.54,38.1 90 top
R52  11.81,38.1 90 top
R53  11.18,39.88 180 top
SW1  6.1,18.29 0 top
SW2  6.1,13.72 0 top
SW3  6.1,9.14 0 top
U1  45.21,17.78 180 top
U2  84.58,41.66 0 top
U3  75.18,41.66 0 top
U4  65.79,41.66 0 top
U5  69.6,12.95 180 top
U6  81.28,6.35 0 top
U$1  59.94,-3.05 0 top  (outside the outline)
U$2  8.89,0.51 0 top
U$3  8.13,30.48 0 top
VOLT_SW  79.5,25.02 0 top
X1  62.48,21.34 180 top

### Tracks (layer width: path | path; a pad name or v marks a point on that pad's centre or on a via)
1.2V  (via drill 0.5)
  Top 0.254: U1.116 39.96,9.57 v39.88,9.65 | v37.08,9.65 36.46,9.03 U1.109 36.46,5.8 35.99,5.33 31.74,5.33 C35.P$1 | v36.83,12.19 36.67,12.03 U1.102 31.58,12.03 C34.P$1 | v50.04,26.16 49.96,26.24 U1.45 49.96,29.9 50.8,30.73 C31.P$1 | v49.02,9.65 48.96,9.59 U1.134 48.96,5.78 48.26,5.08 47.75,5.08 47.24,4.57 C36.P$1 | v53.59,11.18 53.74,11.03 U1.5 58.06,11.03 58.42,10.67 C37.P$1 | v53.59,23.11 53.68,23.03 U1.29 57.57,23.03 58.42,23.88 C38.P$1 | v54.1,26.67 53.96,26.81 U1.37 53.96,29.58 54.61,30.23 C30.P$1 | v42.16,26.16 42.16,27.43 41.96,27.63 U1.61 41.96,30.43 41.66,30.73 41.66,31 C33.P$1 | C32.P$1 31.84,24.03 U1.78 35.21,24.03 35.81,24.64 v36.83,24.64
  Top 0.406: v65.79,42.93 U4.2 65.79,37.08 65.27,36.56 C20.P$1 C19.P$1 65.28,34.02 65.28,32 64.77,31.5 58.93,31.5 v55.63,28.19
  Bottom 0.406: v55.63,28.19 v54.1,26.67 53.59,26.16 | 53.59,26.16 v50.04,26.16 v42.16,26.16 37.34,26.16 36.83,25.65 v36.83,24.64 v36.83,12.19 36.83,9.91 v37.08,9.65 v39.88,9.65 | 53.59,26.16 v53.59,23.11 v53.59,11.18 53.59,10.16 53.09,9.65 v49.02,9.65
  other vias: 62.74,45.97 62.74,44.96 62.74,43.94 62.74,42.93 63.75,42.93 64.77,42.93 66.8,42.93 67.82,42.93 68.83,42.93 68.83,43.94 68.83,44.96 68.83,45.97 62.74,47.24 63.75,47.24 64.77,47.24 65.79,47.24 66.8,47.24 67.82,47.24 68.83,47.24
  pour Bottom: 61.98,48.77 61.98,38.35 69.6,38.35 69.6,48.77
  pour Top: 61.98,48.01 61.98,42.42 69.6,42.42 69.6,48.01
2.5V  (via drill 0.5)
  Top 0.254: C23.P$1 74.92,32.5 72.64,30.23 60.71,30.23 | 60.71,30.23 60.45,30.23 v59.94,29.72 | U1.35 59.55,26.03 C10.P$1 60.69,30.21 60.71,30.23 | v29.21,8.89 29.21,8.38 29.46,8.13 C18.P$1 29.97,8.89 30.23,9.14 33.02,9.14 33.41,9.53 U1.107 | v36.07,22.86 35.74,22.53 U1.81 31.56,22.53 C1.P$1 | v41.4,9.65 40.46,8.71 U1.117 40.46,5.91 C27.P$1 | v43.43,9.65 42.96,9.18 U1.122 42.96,4.85 C28.P$1 | C3.P$1 52.46,31.25 U1.40 52.46,27.55 v52.83,27.18 | U1.47 48.96,30.04 v49.28,30.35 C4.P$1 | C6.P$1 44.45,28.79 | 44.45,28.79 U1.56 | C5.P$1 39.88,30.73 40.13,30.48 41.15,30.48 41.46,30.17 U1.62 41.46,26.98 40.89,26.42 39.88,26.42 v39.37,26.92 | 44.45,28.79 44.45,27.69 v44.96,27.18 | R7.P$1 10.41,20.83 v10.67,20.57 | R8.P$1 10.41,16.76 v10.92,16.26 | R12.P$1 10.41,11.94 v10.92,11.43 | R29.P$1 10.41,7.11 v10.67,6.86
  Top 0.406: U3.2 v75.18,37.34 74.93,37.08 74.93,35.83 C17.P$1 C23.P$1
  Bottom 0.254: v59.94,29.72 52.83,29.72 | 52.83,29.72 49.28,29.72 | 49.28,29.72 44.96,29.72 | 44.96,29.72 39.37,29.72 | 39.37,29.72 33.78,29.72 31.37,27.3 | 31.37,27.3 29.21,25.15 29.21,22.1 | 29.21,22.1 v29.21,8.89 29.21,8.13 30.23,7.11 38.86,7.11 v41.4,9.65 v43.43,9.65 | v36.07,22.86 35.81,22.86 31.37,27.3 | v49.28,30.35 49.28,29.72 | v39.37,26.92 39.37,29.72 | v44.96,27.18 44.96,29.72 | v52.83,27.18 52.83,29.72 | v10.67,6.86 10.92,7.11 v10.92,11.43 v10.92,16.26 10.92,20.32 v10.67,20.57 12.19,22.1 29.21,22.1
  Bottom 0.406: v75.18,42.93 v75.18,37.34
  other vias: 72.14,45.97 72.14,44.96 72.14,43.94 72.14,42.93 73.15,42.93 74.17,42.93 76.2,42.93 77.22,42.93 78.23,42.93 78.23,43.94 78.23,44.96 78.23,45.97 72.14,47.24 73.15,47.24 74.17,47.24 75.18,47.24 76.2,47.24 77.22,47.24 78.23,47.24
  pour Top: 71.37,48.01 71.37,42.42 78.99,42.42 78.99,48.01
  pour Bottom: 71.37,48.77 71.37,38.35 78.99,38.35 78.99,48.77
3.3V  (via drill 0.5)  (1 unrouted)
  Top 0.254: v36.32,48.77 36.35,48.74 J2.P$1 J2.P$2 | J2.P$3 34.35,48.71 v34.29,48.77 | U5.3 74.04,13.59 v74.17,13.72 | U5.8 64.64,11.05 v64.52,10.92 64.27,11.16 C22.P$1 | U5.7 65.41,12.32 v65.28,12.45 64.26,13.46 R4.P$1 | R2.P$2 v78.23,20.07 | R5.P$1 10.41,25.65 v10.67,25.4 | R9.P$1 v78.23,13.21 | R10.P$1 v78.23,11.18 | R3.P$2 v77.47,29.21 | X1.P$4 62.48,21.39 62.48,23.13 C21.P$1 63.23,24.4 v62.74,24.89 | R11.P$1 v61.72,8.64 | U1.96 35.35,15.03 35.81,15.49 35.81,16 35.29,16.53 U1.93 31.78,16.53 31.48,16.23 C13.P$1 29.98,17.5 R6.P$1 | U1.17 58.93,17.03 C25.P$1 60.46,17.28 v60.45,17.27 | C26.P$1 51.46,4.71 U1.139 51.46,7.97 v51.05,8.38 | v46.48,8.38 46.96,7.9 U1.130 46.99,6.75 46.99,5.9 46.42,5.33 46.23,5.33 45.72,4.83 C29.P$1 | C2.P$1 58.42,22.35 57.6,21.53 U1.26 54.8,21.53 v54.61,21.34 | J1.4 65.28,20.07 v65.28,18.8 | U6.1 77.46,5.6 v77.22,5.84 75.7,5.84 C39.P$1
  Top 0.406: U2.2 84.58,37.34 84.33,37.08 84.33,35.83 C12.P$1 C7.P$1 84.32,32.78 v84.33,32.77
  Route15 0.254: v36.32,48.77 36.07,49.02 | v34.29,48.77 34.04,49.02 | v74.17,13.72 74.42,13.97 | v65.28,12.45 65.28,11.68 | v78.23,20.07 78.23,20.32 | v10.67,25.4 11.18,25.4 | v78.23,13.21 78.23,13.46 | v78.23,11.18 78.23,11.68 | v77.47,29.21 77.72,29.46 | v62.74,24.89 62.74,25.4 | v61.72,8.64 61.21,8.13 | v51.05,8.38 51.05,8.64 | v46.48,8.38 46.48,8.64 | v54.61,21.34 54.36,21.34 | v65.28,18.8 65.02,18.8 | v77.22,5.84 77.22,6.35
  Route15 0.406: v84.33,32.77 85.09,32.77
  other vias: 81.53,45.97 81.53,44.96 81.53,43.94 81.53,42.93 87.63,45.97 87.63,44.96 87.63,43.94 87.63,42.93 86.61,42.93 85.6,42.93 84.58,42.93 83.57,42.93 82.55,42.93 35.81,15.75 81.53,47.24 82.55,47.24 83.57,47.24 84.58,47.24 85.6,47.24 86.61,47.24 87.63,47.24
  pour Route15 (isolate 0.305, rank 6): 0,50.55 106.4,50.55 106.4,0 0,0
  pour Top: 80.77,48.01 80.77,42.42 88.39,42.42 88.39,48.01
  pour Bottom: 80.77,48.77 80.77,38.35 88.39,38.35 88.39,48.77
5V  (1 unrouted)
  Top 0.254: VOLT_SW.P$3 84.33,27.3 84.33,28.96 85.22,29.84 C9.P$1
  Top 0.406: U3.3 C11.P$1 C15.P$1 | U4.3 C16.P$1 C24.P$1
  Top 0.813: 77.47,41.4 68.58,41.4 68.07,40.89 68.07,39.13 U4.3 | U3.3 77.48,41.39 77.47,41.4 | C8.P$1 U2.3 86.88,40.82 86.3,41.4 77.47,41.4 | C8.P$1 | C8.P$1 C14.P$1 86.88,29.97 | 86.88,29.97 86.88,29.73 86.87,29.72 | 86.88,29.97 87.13,29.72 97.79,29.72 99.06,30.99 99.06,36.83 97.48,38.41 J7.3
12V
  Top 0.61: J7.2 95,46.23 91.95,49.28 55.37,49.28 54.56,48.47 J3.P$5 J3.P$6
!CONFIG  (via drill 0.5)
  Top 0.254: v6.1,27.94 7.17,29.02 !CONFIG.P$2 10.09,29.02 R5.P$2 | U1.14 62.27,15.53 v62.48,15.75
  Bottom 0.254: v62.48,15.75 62.48,6.86 57.66,2.03 33.78,2.03 33.27,2.54 9.65,2.54 6.1,6.1 v6.1,27.94
!CSO
  Top 0.254: U5.1 70.23,11.05 69.6,11.68 65.02,11.68 64.18,12.53 61.72,12.53 | 61.72,12.53 U1.8 | R11.P$2 61.72,12.53
!STATUS
  Top 0.254: U1.9 60.02,13.03 60.45,13.46 R4.P$2
ASDO
  Top 0.254: U5.5 68.45,14.86 69.09,14.22 69.09,12.95 70.36,11.68 73.56,11.68 73.91,11.32 73.91,10.92 | 73.91,10.92 73.91,10.52 73.56,10.16 64.26,10.16 64.01,10.41 60.71,10.41 59.59,11.53 U1.6 | 73.91,10.92 75.45,10.92 R10.P$2
CLK_50
  Top 0.254: U1.25 57.71,21.03 58.18,20.56 X1.P$3
CLOCK
  Top 0.254: R15.P$1 R22.P$1 85.08,24.38 83.57,24.38 80.03,20.85 U6.21
CLOCK_LS
  Top 0.254: U1.144 53.96,5.98 56.13,3.81 79.25,3.81 79.53,4.09 U6.3
CONF_DONE
  Top 0.254: U1.92 31.74,17.03 31.5,17.27 31.5,17.53 R6.P$2
DATA
  Top 0.254: R16.P$1 R23.P$1 85.08,21.84 83.57,21.84 80.53,18.81 U6.20
DATA0
  Top 0.254: U1.13 65.32,15.03 65.79,15.49 68.73,15.49 69.85,14.38 69.85,13.46 70.99,12.32 U5.2 74.04,12.32 74.93,13.21 R9.P$2
DATA_LS
  Top 0.254: U1.143 53.46,5.72 55.88,3.3 79.76,3.3 80.03,3.58 U6.4
DCLK
  Top 0.254: U5.6 65.66,13.59 64.72,14.53 U1.12
ENABLE
  Top 0.254: R21.P$1 R28.P$1 85.08,9.14 83.57,9.14 83.03,8.61 U6.15
ENABLE_LS
  Top 0.254: U1.135 49.46,5.52 48.26,4.32 48.26,2.39 49.89,0.76 81.53,0.76 82.53,1.76 U6.9
EVEN0+
  Top 0.254: R42.P$1 19.56,34.54 20.07,34.04 42.42,34.04 42.96,33.49 U1.59
EVEN0+_RN
  Top 0.254: J2.P$20 19.14,42.33 19.3,42.16 19.3,40.64 19.09,40.43 R44.P$2 19.09,39.12 R42.P$2
EVEN0-
  Top 0.254: R43.P$1 18.29,34.29 19.05,33.53 42.16,33.53 42.46,33.23 U1.60
EVEN0-_RN
  Top 0.254: J2.P$19 18.35,44.9 17.4,43.94 17.4,40.13 17.65,39.88 R44.P$1 17.99,38.95 R43.P$2
EVEN1+
  Top 0.254: R45.P$1 17.02,34.8 18.8,33.02 34.54,33.02 37.46,30.1 U1.70
EVEN1+_RN
  Top 0.254: J2.P$22 16.38,42.29 16.38,40.77 16.81,40.34 R47.P$2 16.81,38.86 R45.P$2
EVEN1-
  Top 0.254: R46.P$1 15.75,35.31 18.54,32.51 34.29,32.51 36.96,29.84 U1.71
EVEN1-_RN
  Top 0.254: J2.P$21 16.35,45.05 15.37,44.07 15.37,40.77 15.71,40.43 R47.P$1 15.71,38.69 R46.P$2
EVEN2+
  Top 0.254: U1.85 36.62,20.53 38.25,22.16 38.25,25.25 35.05,28.45 35.05,30.99 34.04,32 18.29,32 14.48,35.81 R48.P$1
EVEN2+_RN
  Top 0.254: J2.P$24 14.35,40.64 14.48,40.51 14.48,39.92 R50.P$2 14.52,38.69 R48.P$2
EVEN2-
  Top 0.254: U1.84 36.32,21.03 37.67,22.38 37.67,25.07 34.54,28.19 34.54,30.73 33.78,31.5 18.03,31.5 13.21,36.32 R49.P$1
EVEN2-_RN
  Top 0.254: J2.P$23 14.35,45.09 13.42,44.15 R50.P$1 13.42,39.33 13.21,39.12 R49.P$2
EVENC+
  Top 0.254: U1.121 42.46,5.38 42.16,5.08 41.72,5.08 41.15,4.51 41.15,3.05 40.64,2.54 20.48,2.54 12.7,10.31 12.7,35.05 10.54,37.21 R51.P$1
EVENC+_RN
  Top 0.254: J2.P$28 10.35,40.7 10.63,40.43 R53.P$2 10.63,38.73 R51.P$2
EVENC-
  Top 0.254: U1.120 41.96,5.89 41.66,5.59 41.56,5.59 40.64,4.67 40.64,3.3 40.39,3.05 20.75,3.05 13.21,10.59 13.21,35.31 11.81,36.7 R52.P$1
EVENC-_RN
  Top 0.254: J2.P$27 10.35,44.89 11.3,43.94 11.3,40.89 11.73,40.47 R53.P$1 11.73,38.73 R52.P$2
GND  (via drill 0.5, 0.6)  (7 unrouted)
  Top 0.254: J2.P$5 32.35,48.67 v32.26,48.77 | J2.P$13 24.35,48.55 v24.13,48.77 | J2.P$25 12.35,48.61 v12.19,48.77 | U5.4 74.04,14.86 v74.17,14.99 | !CONFIG.P$4 8.17,25.61 v8.38,25.4 | !RESET.P$4 8.17,20.79 v8.38,20.57 | R1.P$1 v78.23,17.53 | X1.P$2 61.73,22.19 C21.P$2 61.73,24.65 v61.72,24.89 | C22.P$2 v63.5,8.64 | U1.95 32.26,15.53 | 32.26,15.53 32.26,14.99 | U1.94 32.51,16.03 32.26,15.77 32.26,15.53 | v60.2,18.8 60.19,18.78 C25.P$2 58.41,18.78 57.65,18.03 U1.19 55.12,18.03 54.86,18.29 54.86,19.03 | U1.21 54.86,19.03 | U1.22 55.09,19.53 54.86,19.3 54.86,19.03 | v52.32,8.38 51.96,8.02 U1.140 51.96,3.91 C26.P$2 | 39.88,3.82 39.88,4.57 40.96,5.66 U1.118 40.96,7.94 v41.4,8.38 | C30.P$2 v54.61,34.04 | 44.44,32.77 43.94,32.77 43.69,32.51 43.69,30.73 43.96,30.46 U1.57 43.96,27.71 v43.43,27.18 | v40.39,27.18 40.96,27.75 U1.63 40.96,29.65 40.64,29.97 39.62,29.97 39.12,30.48 39.12,32.51 39.37,32.77 39.87,32.77 | C37.P$2 58.92,9.16 57.54,10.53 U1.4 54.98,10.53 v54.61,10.16 | U1.36 58.55,26.53 C10.P$2 59.19,28.46 v59.44,28.7 | v43.94,8.38 43.46,7.9 U1.123 43.46,3.81 | v48.26,27.18 48.46,27.38 U1.48 48.46,32.46 48.77,32.77 49.26,32.77 | v51.56,27.18 51.96,27.58 U1.41 51.96,30.08 51.56,30.48 51.56,32.51 51.8,32.75 | C32.P$2 30.84,23.53 U1.79 35.65,23.53 v36.07,23.88 | 29.98,22.59 30.99,21.59 32.26,21.59 32.7,22.03 U1.82 35.88,22.03 v36.07,21.84 | C13.P$2 31,14.99 32.26,14.99 | v35.81,14.22 35.51,14.53 U1.97 33.22,14.53 32.77,14.99 32.26,14.99 | v35.81,9.4 35.45,9.03 U1.108 33.67,9.03 33.27,8.64 32.26,8.64 31.75,8.13 C18.P$2 | v47.75,8.38 47.46,8.09 U1.131 47.46,5.55 46.48,4.57 46.48,3.31 | C29.P$2 46.48,3.31
  Top 0.254: C36.P$2 46.48,3.31 | 59.68,23.11 58.42,23.11 57.34,22.03 U1.27 54.93,22.03 v54.61,22.33 | 59.68,23.11 C38.P$2 | C2.P$2 59.68,23.11 | J4.2 v98.04,25.65 | J4.4 v98.04,23.11 | J4.6 v98.04,20.57 | J4.8 v98.04,18.03 | J4.12 v98.04,12.95 | J4.10 v98.04,15.49 | J4.14 v98.04,10.41 | C34.P$2 v28.45,11.94 | SW1.P$4 8.17,16.21 v8.38,16 | SW2.P$4 8.17,11.64 v8.38,11.43 | C35.P$2 v28.7,5.59 | v88.65,14.22 88.14,13.72 85.61,13.72 R27.P$2 | R28.P$2 85.61,11.18 88.14,11.18 v88.65,11.68 | R26.P$2 85.61,16.26 88.14,16.26 v88.65,16.76 | R25.P$2 85.61,18.8 88.14,18.8 v88.65,19.3 | R24.P$2 85.61,21.34 88.14,21.34 v88.65,21.84 | R23.P$2 85.61,23.88 88.14,23.88 v88.65,24.38 | R22.P$2 85.61,26.42 88.14,26.42 v88.65,26.92 | D1.CATHODE v75.95,6.86 | D2.CATHODE v75.95,8.89 | J1.10 66.55,27.37 v66.55,26.42 | J1.2 66.55,17.53 v66.55,18.8 | SW3.P$4 8.17,7.07 v8.38,6.86 | U6.12 v85.33,5.6 arc-90 v85.34,5.59 | U6.13 v85.33,7.1 arc90 v85.34,7.11 | U6.11 83.53,3.34 v83.57,3.3 | v77.72,4.57 77.75,4.6 U6.2 76.41,4.6 C39.P$2 | U6.22 79.53,9.37 v79.25,9.65 | C33.P$2 C5.P$2 | C31.P$2 50.8,34.04 v49.78,35.05 | J2.P$14 24.35,43.97 v23.88,44.45 | J2.P$26 12.35,44.04 v11.94,44.45 | J2.P$6 32.35,43.85 v31.75,44.45
  Top 0.406: v72.9,37.08 73.42,36.56 C17.P$2 C23.P$2 | C23.P$2 | C14.P$2 C8.P$2 v88.38,37.07 v88.39,37.08 | v78.99,37.08 v78.98,37.07 C11.P$2 C15.P$2 | v69.6,37.08 69.58,37.07 C16.P$2 C24.P$2 | v82.8,32.77 82.82,32.78 C7.P$2 C12.P$2 | v82.3,37.08 82.8,36.58 82.8,35.81 | v63.5,37.08 63.77,36.82 C20.P$2 63.75,35.8 63.75,34.04 | C19.P$2 63.75,34.02 63.74,34.04 v62.74,34.04 | C23.P$2 73.41,34.04 v72.39,34.04
  Top 0.61: J3.P$1 46.56,47.32 v47.5,48.26 48.56,47.2 J3.P$2
  Top 0.813: U4.1 63.49,37.1 v63.5,37.08 | U3.1 72.88,37.1 v72.9,37.08 | U2.1 82.28,37.1 v82.3,37.08 | C9.P$2 arc90 82.04,30.13 v82.04,31.5
  Route2 0.254: v32.26,48.77 32,49.02 | v24.13,48.77 24.38,49.02 | v12.19,48.77 12.19,49.02 | 68.33,29.46 68.33,29.72 | v74.17,14.99 73.15,15.24 | v8.38,25.4 8.64,25.4 | v8.38,20.57 8.89,20.57 | v78.23,17.53 78.23,18.03 | v59.44,28.7 59.69,28.45 | v60.2,18.8 60.2,19.05 | v52.32,8.38 52.32,9.14 | v41.4,8.38 41.4,8.64 | v54.61,34.04 54.61,34.8 | v43.43,27.18 43.43,26.92 | 45.21,3.3 45.21,3.81 | v54.61,10.16 54.61,9.65 | v43.94,8.38 43.94,8.64 | v48.26,27.18 47.75,27.18 | v51.56,27.18 51.56,26.92 | v36.07,21.84 36.32,21.84 | v35.81,9.4 35.81,9.91 | v47.75,8.38 47.75,8.64 | v54.61,22.33 54.86,22.35 | v98.04,25.65 98.04,25.91 | v98.04,23.11 98.04,23.37 | v98.04,20.57 98.04,20.83 | v98.04,18.03 98.04,18.29 | v98.04,12.95 98.04,13.21 | v98.04,15.49 98.04,15.75 | v98.04,10.41 98.04,10.67 | v28.45,11.94 28.19,11.94 | v8.38,16 8.64,16 | v8.38,11.43 8.89,11.43 | v28.7,5.59 28.7,5.84 | v88.65,14.22 89.15,14.22 | v88.65,11.68 88.65,12.19 | v88.65,16.76 88.9,16.76 | v88.65,19.3 88.9,19.3 | v88.65,24.38 88.9,24.38 | v88.65,26.92 88.9,26.92 | v75.95,6.86 75.95,7.37 | v75.95,8.89 75.95,9.4 | v66.55,26.42 66.04,26.42 | v8.38,6.86 8.89,6.86 | v83.57,3.3 83.57,3.05 | v77.72,4.57 77.22,4.57 | v79.25,9.65 79.25,9.91 | v49.78,35.05 49.78,35.56
  Route2 0.406: v72.39,34.04 72.9,32.77 | v88.39,37.08 88.39,37.34 88.65,37.59 | v78.99,37.08 78.99,37.34 79.25,37.59 | v69.6,37.08 70.1,37.08 | v82.8,32.77 82.8,32.51 83.06,32.26 | v62.74,34.04 63.75,32.26
  Route2 0.813: v63.5,37.08 64.26,37.08 | v72.9,37.08 73.41,37.08 | v82.3,37.08 82.8,37.08 | v82.04,31.5 82.04,32.26
  other vias: 41.66,17.78 45.21,21.34 48.77,17.78 45.21,14.22 41.66,14.22 41.66,21.34 48.77,21.34 48.77,14.22 48.77,16 48.77,19.56 46.99,21.34 43.43,21.34 41.66,19.56 41.66,16 43.43,14.22 46.99,14.22
  pour Route2 (isolate 0.305, rank 6): 0,50.55 106.4,50.55 106.4,0 0,0
  pour Top: 41.15,21.84 41.15,13.72 49.28,13.72 49.28,21.84
LATCH
  Top 0.254: R17.P$1 R24.P$1 85.08,19.3 83.57,19.3 81.03,16.77 U6.19
LATCH_LS
  Top 0.254: U1.142 52.96,5.46 55.63,2.79 80.26,2.79 80.53,3.06 U6.5
LCD_PWR_M1
  Top 0.813: 42.67,46.23 45.21,46.23 | 44.2,48.26 44.2,43.94
  pour Top (isolate 0.305): 41.91,48.77 45.72,48.77 45.72,40.89 41.91,40.89
LCD_PWR_M2
  Top 0.813: 57.91,46.23 60.2,46.23 | 58.93,48.26 58.93,43.94
  pour Top (isolate 0.305): 57.4,48.77 61.21,48.77 61.21,40.89 57.4,40.89
N$1
  Top 0.254: R13.P$2 D1.ANODE
N$2
  Top 0.254: R14.P$2 D2.ANODE
N$3
  Top 0.254: R15.P$2 J4.1
N$4
  Top 0.254: R16.P$2 J4.3
N$5
  Top 0.254: R17.P$2 J4.5
N$6
  Top 0.254: J4.7 R18.P$2
N$7
  Top 0.254: R19.P$2 J4.9
N$8
  Top 0.254: R20.P$2 J4.11 93.22,12.95
N$9
  Top 0.254: J4.13 R21.P$2
ODD0+
  Top 0.254: U1.38 53.46,30.09 53.85,30.48 53.85,35.05 49.78,39.12 34.29,39.12 33.53,39.88 R31.P$1
ODD0+_RN
  Top 0.254: J2.P$8 30.52,42.16 R32.P$2 R31.P$2
ODD0-
  Top 0.254: U1.39 52.96,30.36 53.34,30.73 53.34,34.8 49.53,38.61 R30.P$1
ODD0-_RN
  Top 0.254: J2.P$7 30.35,44.83 29.42,43.9 R32.P$1 29.42,39.16 29.97,38.61 R30.P$2
ODD1+
  Top 0.254: R33.P$1 28.7,37.21 28.83,37.08 45.97,37.08 48.01,35.05 48.01,29.72 47.96,29.67 U1.49
ODD1+_RN
  Top 0.254: J2.P$10 28.24,42.21 R35.P$2 28.24,39.12 R33.P$2
ODD1-
  Top 0.254: R34.P$1 27.18,36.83 27.43,36.58 45.72,36.58 47.5,34.8 47.5,29.97 47.46,29.94 U1.50
ODD1-_RN
  Top 0.254: J2.P$9 28.35,44.86 27.43,43.94 27.43,40.64 27.18,40.39 27.18,39.92 R35.P$1 27.14,38.69 R34.P$2
ODD2+
  Top 0.254: R36.P$1 25.91,36.32 26.16,36.07 45.47,36.07 46.99,34.54 46.99,30.23 46.46,29.7 U1.52
ODD2+_RN
  Top 0.254: J2.P$12 26.35,40.83 25.95,40.43 R38.P$2 25.95,38.69 R36.P$2
ODD2-
  Top 0.254: R37.P$1 24.64,35.81 24.89,35.56 45.21,35.56 46.48,34.29 46.48,30.48 45.96,29.96 U1.53
ODD2-_RN
  Top 0.254: J2.P$11 26.35,44.89 25.4,43.94 25.4,40.89 24.85,40.34 R38.P$1 24.85,38.86 R37.P$2
ODDC+
  Top 0.254: R39.P$1 23.37,35.31 23.62,35.05 44.96,35.05 45.97,34.04 45.97,30.73 45.46,30.22 U1.54
ODDC+_RN
  Top 0.254: J2.P$16 23.21,42.33 23.37,42.16 23.37,40.64 23.62,40.39 23.62,39.92 R41.P$2 23.66,38.95 R39.P$2
ODDC-
  Top 0.254: R40.P$1 22.1,34.8 22.35,34.54 44.7,34.54 45.47,33.78 45.47,30.99 44.96,30.48 U1.55
ODDC-_RN
  Top 0.254: J2.P$15 22.35,44.96 21.34,43.94 21.34,40.6 22.05,39.88 R41.P$1 22.56,39.12 R40.P$2
PIN_1
  Top 0.254: U1.1 57.26,9.03 57.66,8.64 57.66,8.13 58.42,7.37 65.53,7.37 66.04,6.86 R13.P$1
PIN_2
  Top 0.254: U1.2 57.53,9.53 58.17,8.89 58.17,8.38 58.67,7.87 65.53,7.87 66.55,8.89 R14.P$1
PIN_73
  Top 0.254: U1.73 33.67,26.53 31.75,28.45 J5.P$1
PIN_74
  Top 0.254: U1.74 33.41,26.03 32.26,27.18 21.34,27.18 J6.P$1
PIN_75
  Top 0.254: U1.75 33.14,25.53 32.51,26.16 22.86,26.16 J5.P$2
PIN_76
  Top 0.254: U1.76 32.88,25.03 32.26,25.65 24.38,25.65 23.37,24.64 21.34,24.64 J6.P$2
PIN_77
  Top 0.254: U1.77 32.62,24.53 32,25.15 24.64,25.15 22.86,23.37 J5.P$3
PIN_83
  Top 0.254: U1.83 32.96,21.53 32.51,21.08 29.97,21.08 28.96,22.1 21.34,22.1 J6.P$3
PIN_86
  Top 0.254: U1.86 29.75,20.03 28.96,20.83 J5.P$4
PIN_87
  Top 0.254: J6.P$4 21.36,19.53 U1.87
PIN_88
  Top 0.254: U1.88 23.35,19.03 J5.P$5
PIN_89
  Top 0.254: U1.89 26.15,18.53 24.64,17.02 21.34,17.02 J6.P$5
PIN_98
  Top 0.254: J5.P$6 27.69,15.75 29.21,14.22 32.77,14.22 32.96,14.03 U1.98
PIN_99
  Top 0.254: J6.P$6 21.34,14.48 27.94,14.48 28.7,13.72 32.51,13.72 32.7,13.53 U1.99
PIN_100
  Top 0.254: U1.100 32.44,13.03 32.26,13.21 J5.P$7
PIN_101
  Top 0.254: U1.101 32.17,12.53 32,12.7 25.4,12.7 24.64,11.94 21.34,11.94 J6.P$7
PIN_103
  Top 0.254: U1.103 32.36,11.53 32,11.18 23.11,11.18 J5.P$8
PIN_104
  Top 0.254: U1.104 32.62,11.03 32.26,10.67 25.91,10.67 24.64,9.4 21.34,9.4 J6.P$8
PIN_105
  Top 0.254: U1.105 32.88,10.53 32.51,10.16 26.92,10.16 24.89,8.13 J5.P$9
PIN_106
  Top 0.254: U1.106 33.14,10.03 32.77,9.65 27.43,9.65 24.64,6.86 21.34,6.86 J6.P$9
PIN_110  (via drill 0.5)
  Top 0.254: SW1.P$2 10.09,19.36 R8.P$2 11.67,19.04 v11.68,19.05 | v34.8,4.32 35.81,4.32 36.96,5.47 U1.110
  Bottom 0.254: v11.68,19.05 11.68,15.24 12.19,14.73 12.19,10.67 18.54,4.32 v34.8,4.32
PIN_111  (via drill 0.5)
  Top 0.254: SW2.P$2 10.09,14.79 R12.P$2 | R12.P$2 10.43,14.48 | v36.58,4.06 37.46,4.95 U1.111 | v13.72,8.13 12.19,9.65 12.19,13.46 11.19,14.47 R12.P$2
  Bottom 0.254: v13.72,8.13 18.29,3.56 36.07,3.56 v36.58,4.06
PIN_112  (via drill 0.5)
  Top 0.254: U1.112 37.96,5.73 v38.35,5.33 | v11.94,8.38 11.94,8.64 11.43,9.14 11.43,9.65 11.18,9.91 10.43,9.91 R29.P$2 10.09,10.22 SW3.P$2
  Bottom 0.254: v38.35,5.33 38.35,4.57 36.83,3.05 15.24,3.05 11.94,6.35 v11.94,8.38
PWM/EN  (via drill 0.5)
  Top 0.254: v53.59,39.12 52.96,39.75 52.56,40.15 J3.P$4 | v59.69,13.72 59.5,13.53 U1.10
  Bottom 0.254: v53.59,39.12 56.13,39.12 62.99,32.26 62.99,26.67 63.5,26.16 63.5,23.37 62.99,22.86 62.99,19.56 62.23,18.8 62.23,18.03 59.69,15.49 v59.69,13.72
REG0
  Top 0.254: R20.P$1 R27.P$1 85.08,11.68 83.57,11.68 82.53,10.65 U6.16
REG0_LS
  Top 0.254: U1.137 50.46,5.76 48.77,4.06 48.77,2.54 50.04,1.27 81.28,1.27 82.03,2.02 U6.8 82.04,4.33
REG1
  Top 0.254: R19.P$1 R26.P$1 85.08,14.22 83.57,14.22 82.03,12.69 U6.17
REG1_LS
  Top 0.254: U1.138 50.96,5.5 49.28,3.81 49.28,2.69 50.19,1.78 81.03,1.78 81.53,2.29 81.53,4.34 U6.7
REG2
  Top 0.254: R18.P$1 R25.P$1 85.08,16.76 83.57,16.76 81.53,14.73 U6.18
REG2_LS
  Top 0.254: U1.141 52.46,5.2 55.37,2.29 80.52,2.29 81.03,2.8 U6.6
RESET
  Top 0.254: U1.125 44.46,5.09 44.45,5.08 44.45,3.51 42.97,2.03 10.26,2.03 6.1,6.2 6.1,23.11 7.17,24.19 !RESET.P$2 10.09,24.19 R7.P$2
TCK
  Top 0.254: U1.16 60.73,16.53 61.21,17.02 63.5,17.02 64.26,16.26 70.87,16.26 71.31,16.26 | R1.P$2 75.18,17.53 73.91,16.26 71.31,16.26 | 71.31,16.26 J1.1
TDI  (via drill 0.5)
  Top 0.254: U1.15 61.44,16.03 61.47,16.06 v61.47,16.26 | J1.9 72.9,27.69 v72.9,29.21 R3.P$1
  Bottom 0.254: v61.47,16.26 62.74,17.53 62.74,18.54 63.5,19.3 63.5,22.61 64.01,23.11 64.01,28.45 64.77,29.21 v72.9,29.21
TDO
  Top 0.254: U1.20 57.39,18.53 58.42,19.56 64.01,19.56 64.26,19.81 64.26,20.83 64.77,21.34 70.87,21.34 71.31,20.89 J1.3
TMS  (via drill 0.5)
  Top 0.254: U1.18 58.17,17.53 58.67,18.03 63.25,18.03 v63.5,18.29 | v71.37,23.88 71.37,22.61 J1.5 74.68,22.61 75.69,21.59 R2.P$1
  Bottom 0.254: v63.5,18.29 64.26,19.05 64.26,22.1 66.04,23.88 v71.37,23.88
VCCB
  Top 0.254: VOLT_SW.P$2 79.5,11.18 78.49,10.16 78.49,9.4 | 78.49,9.4 79.03,8.85 U6.23 | U6.24 77.99,7.1 77.72,7.37 77.72,8.64 78.49,9.4

### Text on the board
tPlace: PWR | RED WIRES | LCD POWER | LCD DATA | PROG | DMD DATA